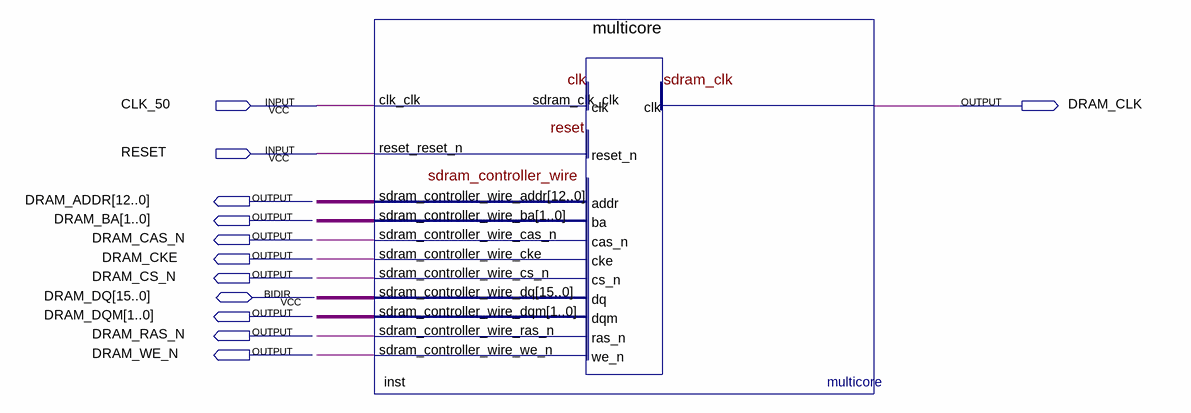
[diagram p0: schematic sheet]
// Quartus schematic Block1.bdf as structural Verilog: 1 symbols, 12 pins
module Block1 (
  input  CLK_50,
  input  RESET,
  inout  [15:0] DRAM_DQ,
  output DRAM_CLK,
  output [12:0] DRAM_ADDR,
  output [1:0] DRAM_BA,
  output DRAM_CAS_N,
  output DRAM_CKE,
  output DRAM_CS_N,
  output [1:0] DRAM_DQM,
  output DRAM_RAS_N,
  output DRAM_WE_N
);

  multicore inst (
    .clk_clk(CLK_50), .reset_reset_n(RESET), .sdram_clk_clk(DRAM_CLK),
    .sdram_controller_wire_addr(DRAM_ADDR), .sdram_controller_wire_ba(DRAM_BA),
    .sdram_controller_wire_cas_n(DRAM_CAS_N), .sdram_controller_wire_cke(DRAM_CKE),
    .sdram_controller_wire_cs_n(DRAM_CS_N), .sdram_controller_wire_dqm(DRAM_DQM),
    .sdram_controller_wire_ras_n(DRAM_RAS_N), .sdram_controller_wire_we_n(DRAM_WE_N),
    .sdram_controller_wire_dq(DRAM_DQ));
endmodule
